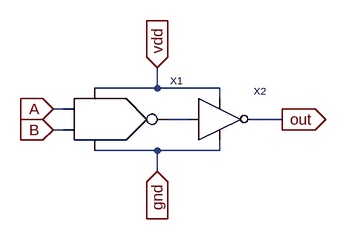
[diagram p0: schematic and.asc]
and.asc, the LTspice schematic file:
Version 4.1
SHEET 1 880 680
WIRE 304 112 304 80
WIRE 304 112 208 112
WIRE 400 112 304 112
WIRE 400 128 400 112
WIRE 160 144 144 144
WIRE 352 160 320 160
WIRE 496 160 448 160
WIRE 160 176 144 176
WIRE 304 208 208 208
WIRE 400 208 400 192
WIRE 400 208 304 208
WIRE 304 240 304 208
FLAG 144 144 A
IOPIN 144 144 In
FLAG 144 176 B
IOPIN 144 176 In
FLAG 304 80 vdd
IOPIN 304 80 In
FLAG 304 240 gnd
IOPIN 304 240 In
FLAG 496 160 out
IOPIN 496 160 Out
SYMBOL nand 208 160 R0
SYMATTR InstName X1
SYMBOL inv 400 160 R0
SYMATTR InstName X2

The netlist it stands for:
* and.asc
X§X1 A B N001 vdd gnd nand  ; pins A B out vdd gnd
X§X2 out N001 vdd gnd inv  ; pins out in vdd gnd
.backanno
.end